# Altium schematic sheet 核心板.SchDoc: 阿波罗简易型控制器核心板
size A3; CompanyName: 东莞市月无声电子设备有限公司; Revision: V1.2; DocumentName: 阿波罗简易型控制器核心板
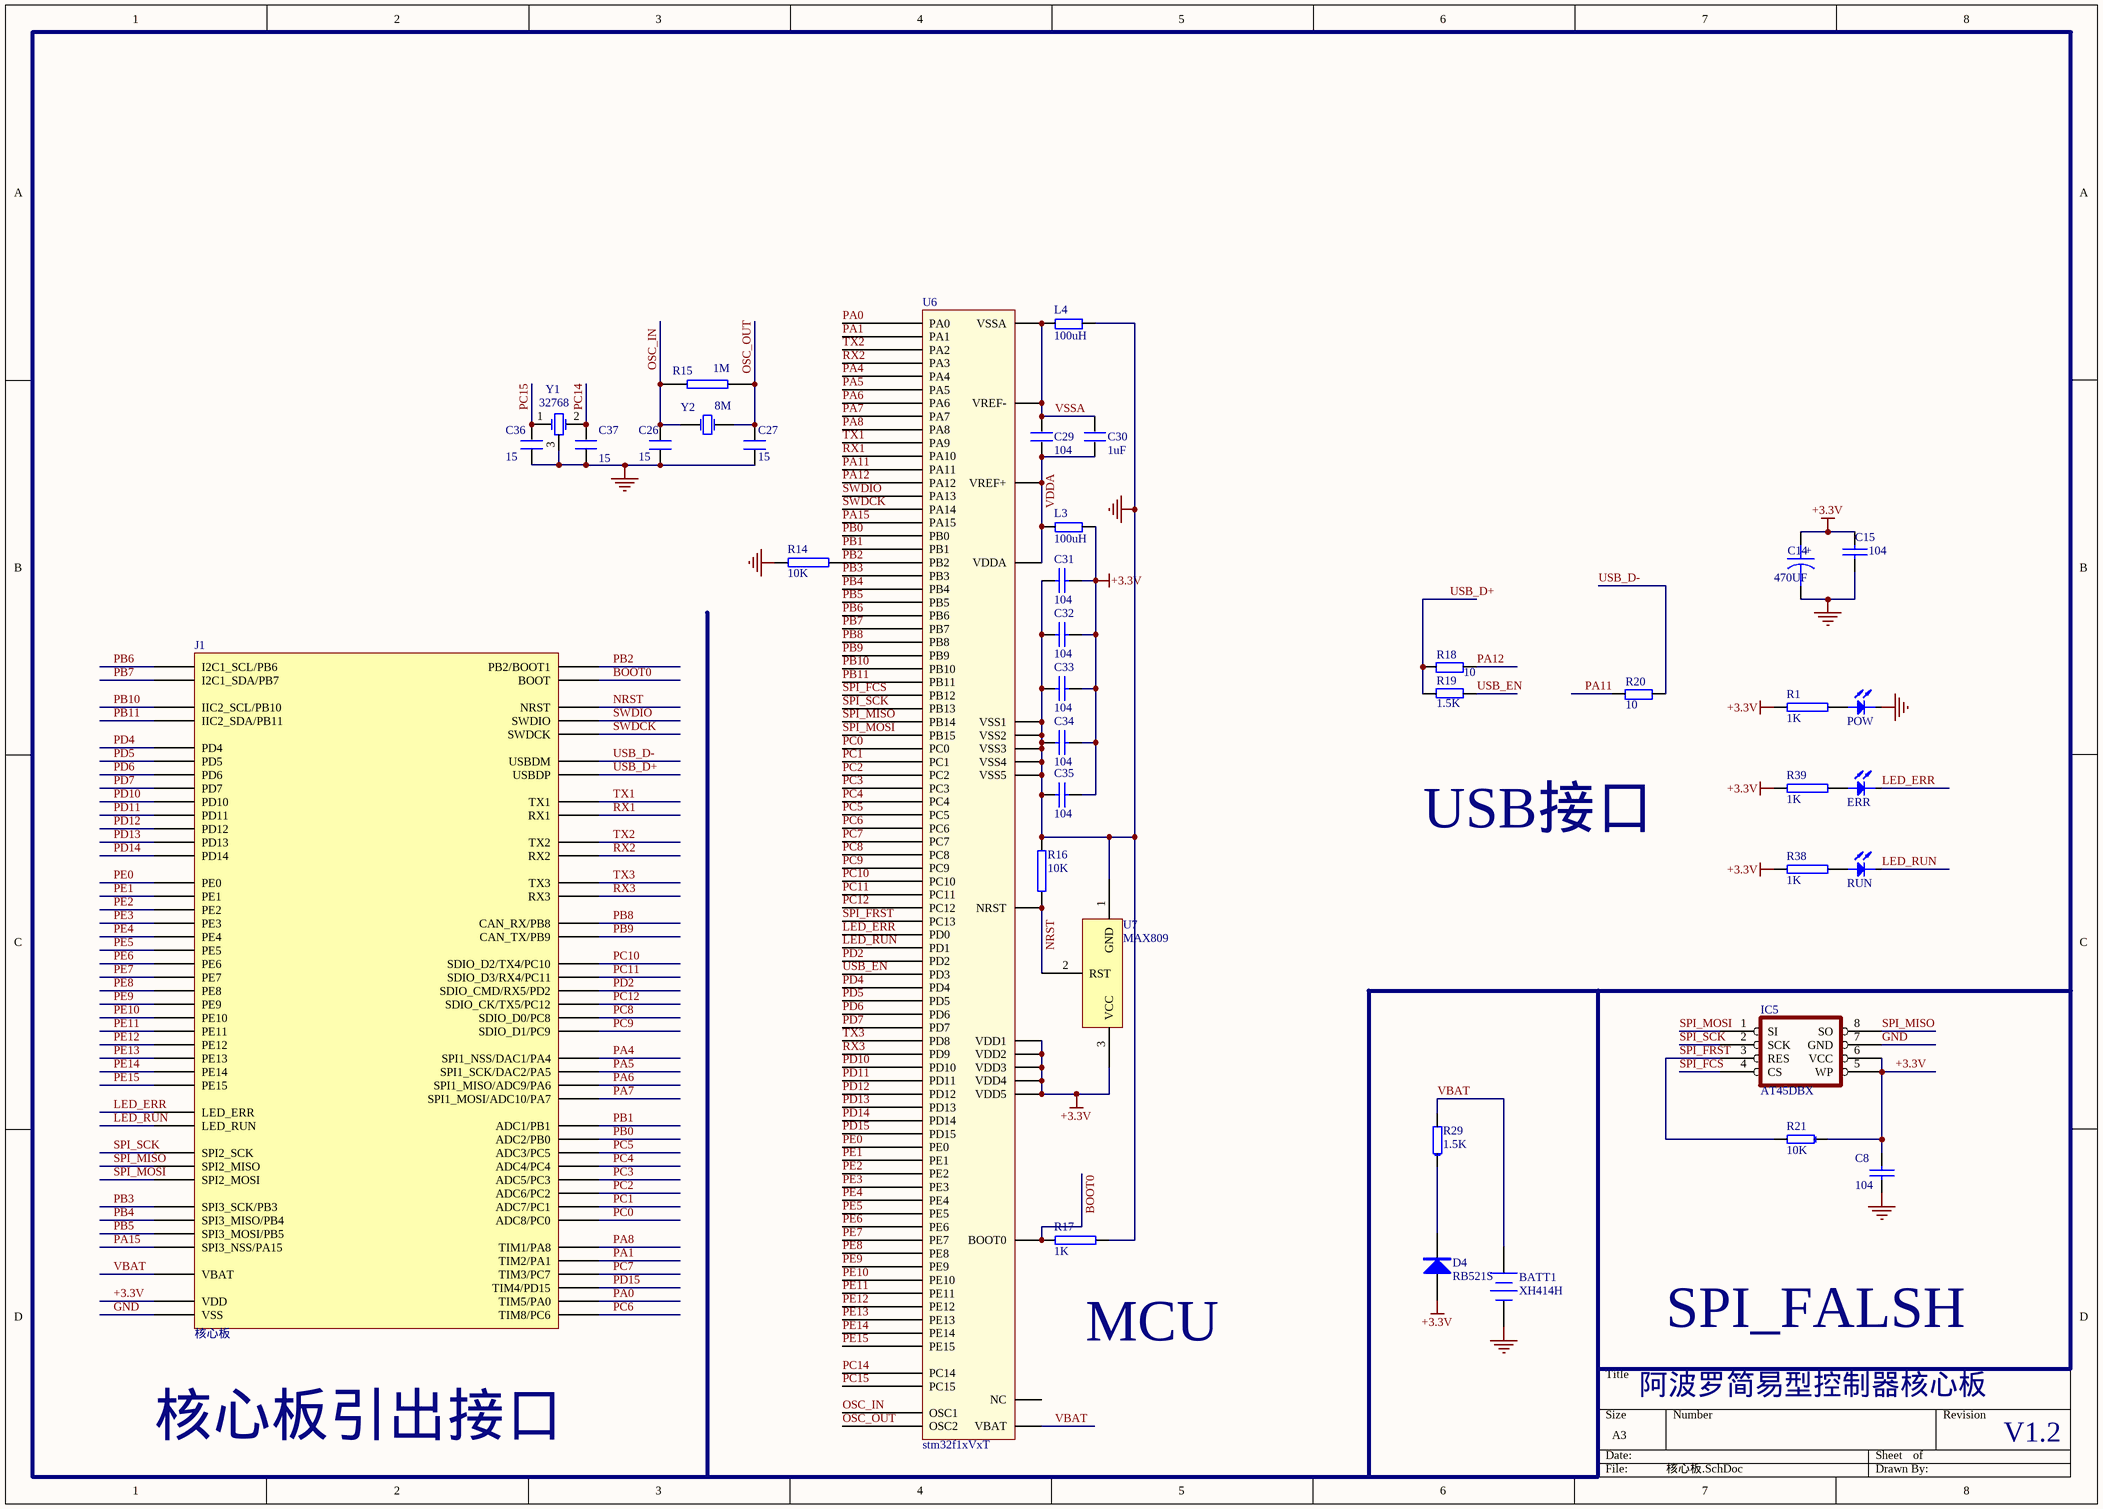
[diagram p0: 核心板.SchDoc]

## Parts
BATT1  XH414H  [XH414H_IV01E]
C8  104  [0603A]
C14  470UF  [1206C]
C15  104  [0603A]
C26  15  [0603A]
C27  15  [0603A]
C29  104  [0603A]
C30  1uF  [0805]
C31  104  [0603A]
C32  104  [0603A]
C33  104  [0603A]
C34  104  [0603A]
C35  104  [0603A]
C36  15  [0603A]
C37  15  [0603A]
D4  RB521S  [0603D]
ERR  (no value)  [SMDLED]
IC5  AT45DBX  [SOIC-8]
J1  核心板  [核心板-物联网1]
L3  100uH  [0805]
L4  100uH  [0805]
POW  (no value)  [SMDLED]
R1  1K  [0603A]
R14  10K  [0603A]
R15  1M  [0603A]
R16  10K  [0603A]
R17  1K  [0603A]
R18  10  [0603A]
R19  1.5K  [0603A]
R20  10  [0603A]
R21  10K  [0603A]
R29  1.5K  [0603A]
R38  1K  [0603A]
R39  1K  [0603A]
RUN  (no value)  [SMDLED]
U6  stm32f1xVxT
U7  MAX809  [SOT23]
Y1  32768  [MC-146]
Y2  8M  [XTAL-5032]

## Nets
+3.3V: C8.1 C14.1 C15.1 C31.1 C32.1 C33.1 C34.1 C35.1 D4.A IC5.5(WP) IC5.6(VCC) J1.2(VDD) L3.2 R1.1 R21.1 R38.1 R39.1 U6.11(VDD5) U6.28(VDD4) U6.50(VDD1) U6.75(VDD2) U6.100(VDD3) U7.3(VCC)
GND: BATT1.2(-) C8.2 C14.2 C15.2 C26.2 C27.2 C31.2 C32.2 C33.2 C34.2 C35.2 C36.1 C37.1 IC5.7(GND) J1.1(VSS) L4.2 POW.K R14.1 R16.2 R17.1 U6.10(VSS5) U6.27(VSS4) U6.49(VSS1) U6.74(VSS2) U6.99(VSS3) U7.1(GND) Y1.3
BOOT0: J1.3(BOOT) R17.2 U6.94(BOOT0)
LED_ERR: ERR.K J1.11(LED_ERR) U6.81(PD0)
LED_RUN: J1.12(LED_RUN) RUN.K U6.82(PD1)
NRST: J1.4(NRST) R16.1 U6.14(NRST) U7.2(RST)
OSC_IN: C26.1 R15.1 U6.12(OSC1) Y2.2(OSC2)
OSC_OUT: C27.1 R15.2 U6.13(OSC2) Y2.1(OSC1)
PA0: J1.45(TIM5/PA0) U6.23(PA0)
PA1: J1.46(TIM2/PA1) U6.24(PA1)
PA4: J1.39(SPI1_NSS/DAC1/PA4) U6.29(PA4)
PA5: J1.40(SPI1_SCK/DAC2/PA5) U6.30(PA5)
PA6: J1.37(SPI1_MISO/ADC9/PA6) U6.31(PA6)
PA7: J1.38(SPI1_MOSI/ADC10/PA7) U6.32(PA7)
PA8: J1.43(TIM1/PA8) U6.67(PA8)
PA11: R20.1 U6.70(PA11)
PA12: R18.2 U6.71(PA12)
PA15: J1.74(SPI3_NSS/PA15) U6.77(PA15)
PB0: J1.34(ADC2/PB0) U6.35(PB0)
PB1: J1.33(ADC1/PB1) U6.36(PB1)
PB2: J1.31(PB2/BOOT1) R14.2 U6.37(PB2)
PB3: J1.73(SPI3_SCK/PB3) U6.89(PB3)
PB4: J1.72(SPI3_MISO/PB4) U6.90(PB4)
PB5: J1.71(SPI3_MOSI/PB5) U6.91(PB5)
PB6: J1.70(I2C1_SCL/PB6) U6.92(PB6)
PB7: J1.69(I2C1_SDA/PB7) U6.93(PB7)
PB8: J1.68(CAN_RX/PB8) U6.95(PB8)
PB9: J1.67(CAN_TX/PB9) U6.96(PB9)
PB10: J1.22(IIC2_SCL/PB10) U6.47(PB10)
PB11: J1.21(IIC2_SDA/PB11) U6.48(PB11)
PC0: J1.49(ADC8/PC0) U6.15(PC0)
PC1: J1.50(ADC7/PC1) U6.16(PC1)
PC2: J1.47(ADC6/PC2) U6.17(PC2)
PC3: J1.48(ADC5/PC3) U6.18(PC3)
PC4: J1.36(ADC4/PC4) U6.33(PC4)
PC5: J1.35(ADC3/PC5) U6.34(PC5)
PC6: J1.41(TIM8/PC6) U6.63(PC6)
PC7: J1.44(TIM3/PC7) U6.64(PC7)
PC8: J1.76(SDIO_D0/PC8) U6.65(PC8)
PC9: J1.75(SDIO_D1/PC9) U6.66(PC9)
PC10: J1.79(SDIO_D2/TX4/PC10) U6.78(PC10)
PC11: J1.80(SDIO_D3/RX4/PC11) U6.79(PC11)
PC12: J1.78(SDIO_CK/TX5/PC12) U6.80(PC12)
PC14: C37.2 U6.8(PC14) Y1.2(OSC2)
PC15: C36.2 U6.9(PC15) Y1.1(OSC1)
PD2: J1.77(SDIO_CMD/RX5/PD2) U6.83(PD2)
PD4: J1.63(PD4) U6.85(PD4)
PD5: J1.64(PD5) U6.86(PD5)
PD6: J1.65(PD6) U6.87(PD6)
PD7: J1.66(PD7) U6.88(PD7)
PD10: J1.13(PD10) U6.57(PD10)
PD11: J1.62(PD11) U6.58(PD11)
PD12: J1.61(PD12) U6.59(PD12)
PD13: J1.60(PD13) U6.60(PD13)
PD14: J1.59(PD14) U6.61(PD14)
PD15: J1.42(TIM4/PD15) U6.62(PD15)
PE0: J1.58(PE0) U6.97(PE0)
PE1: J1.57(PE1) U6.98(PE1)
PE2: J1.56(PE2) U6.1(PE2)
PE3: J1.55(PE3) U6.2(PE3)
PE4: J1.54(PE4) U6.3(PE4)
PE5: J1.53(PE5) U6.4(PE5)
PE6: J1.52(PE6) U6.5(PE6)
PE7: J1.51(PE7) U6.38(PE7)
PE8: J1.30(PE8) U6.39(PE8)
PE9: J1.29(PE9) U6.40(PE9)
PE10: J1.28(PE10) U6.41(PE10)
PE11: J1.27(PE11) U6.42(PE11)
PE12: J1.26(PE12) U6.43(PE12)
PE13: J1.25(PE13) U6.44(PE13)
PE14: J1.24(PE14) U6.45(PE14)
PE15: J1.23(PE15) U6.46(PE15)
RX1: J1.10(RX1) U6.69(PA10)
RX2: J1.18(RX2) U6.26(PA3)
RX3: J1.20(RX3) U6.56(PD9)
SPI_FCS: IC5.4(CS) U6.51(PB12)
SPI_FRST: IC5.3(RES) R21.2 U6.7(PC13)
SPI_MISO: IC5.8(SO) J1.15(SPI2_MISO) U6.53(PB14)
SPI_MOSI: IC5.1(SI) J1.16(SPI2_MOSI) U6.54(PB15)
SPI_SCK: IC5.2(SCK) J1.14(SPI2_SCK) U6.52(PB13)
SWDCK: J1.6(SWDCK) U6.76(PA14)
SWDIO: J1.5(SWDIO) U6.72(PA13)
TX1: J1.9(TX1) U6.68(PA9)
TX2: J1.17(TX2) U6.25(PA2)
TX3: J1.19(TX3) U6.55(PD8)
USB_D+: J1.8(USBDP) R18.1 R19.2
USB_D-: J1.7(USBDM) R20.2
USB_EN: R19.1 U6.84(PD3)
VBAT: BATT1.1(+) J1.32(VBAT) R29.2 U6.6(VBAT)
VDDA: C29.2 C30.2 L3.1 U6.21(VREF+) U6.22(VDDA)
VSSA: C29.1 C30.1 L4.1 U6.19(VSSA) U6.20(VREF-)
NetD4_K: D4.K R29.1
NetERR_A: ERR.A R39.2
NetPOW_A: POW.A R1.2
NetR38_2: R38.2 RUN.A

Not connected (* = marked no-connect by the designer): U6 73(NC)

## Notes on the sheet
- USB接口
- MCU
- SPI_FALSH
- 核心板引出接口
- (in symbol CAPACITOR POL) +

## Library data of the parts
BATT1 = Battery: Published: 24-Mar-1999; LatestRevisionDate: 17-Jul-2002; LatestRevisionNote: Re-released for DXP Platform.; PackageReference: BAT-2; Publisher: Altium Limited; PackageDescription: Battery; 2 Leads
C8 C15 C31-C35 = CAP: Capacitor
C14 = CAPACITOR POL: Capacitor
C26 C27 C29 C30 C36 C37 = C
D4 = 二极管
ERR POW RUN = LED
J1 = 物联网核心板
L3 L4 R18-R21 R29 = R
R1 R14-R17 R38 R39 = RES2
U7 = MAX809/810
Y1 = XTAL_32: Crystal Oscillator; Published: 8-Jun-2000; LatestRevisionDate: 17-Jul-2002; LatestRevisionNote: Re-released for DXP Platform.; Publisher: Altium Limited; PackageReference: R38
Y2 = XTAL: Crystal Oscillator; Published: *; LatestRevisionDate: *; LatestRevisionNote: *; Publisher: *